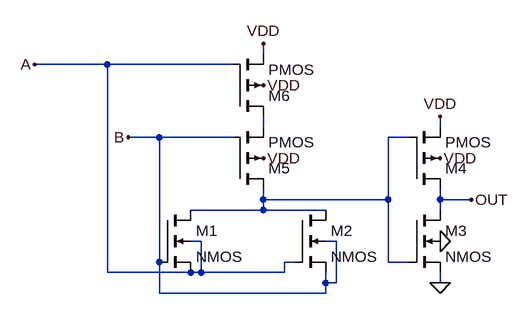
[diagram p0: schematic XOR.asc]
XOR.asc, the LTspice schematic file:
Version 4
SHEET 1 1076 680
WIRE 560 -416 560 -432
WIRE 320 -400 208 -400
WIRE 512 -400 320 -400
WIRE 560 -304 560 -320
WIRE 832 -304 832 -320
WIRE 400 -288 352 -288
WIRE 512 -288 400 -288
WIRE 784 -288 752 -288
WIRE 560 -192 560 -208
WIRE 752 -192 752 -288
WIRE 752 -192 560 -192
WIRE 832 -192 832 -208
WIRE 880 -192 832 -192
WIRE 560 -176 560 -192
WIRE 560 -176 448 -176
WIRE 656 -176 560 -176
WIRE 832 -176 832 -192
WIRE 464 -128 448 -128
WIRE 672 -128 656 -128
WIRE 400 -96 400 -288
WIRE 608 -96 592 -96
WIRE 752 -96 752 -192
WIRE 784 -96 752 -96
WIRE 320 -80 320 -400
WIRE 448 -80 320 -80
WIRE 464 -80 464 -128
WIRE 464 -80 448 -80
WIRE 592 -80 592 -96
WIRE 592 -80 464 -80
WIRE 656 -64 656 -80
WIRE 672 -64 672 -128
WIRE 672 -64 656 -64
WIRE 832 -64 832 -80
WIRE 400 -48 400 -96
WIRE 656 -48 656 -64
WIRE 656 -48 400 -48
FLAG 208 -400 A
FLAG 560 -256 VDD
FLAG 560 -368 VDD
FLAG 560 -432 VDD
FLAG 832 -128 0
FLAG 832 -64 0
FLAG 832 -256 VDD
FLAG 832 -320 VDD
FLAG 352 -288 B
FLAG 880 -192 OUT
SYMBOL nmos4 400 -176 R0
SYMATTR InstName M1
SYMBOL nmos4 608 -176 R0
SYMATTR InstName M2
SYMBOL nmos4 784 -176 R0
SYMATTR InstName M3
SYMBOL pmos4 784 -208 M180
SYMATTR InstName M4
SYMBOL pmos4 512 -208 M180
SYMATTR InstName M5
SYMBOL pmos4 512 -320 M180
SYMATTR InstName M6

The netlist it stands for:
* XOR.asc
M1 N002 B A A NMOS
M2 N002 A B B NMOS
M3 OUT N002 0 0 NMOS
M4 OUT N002 VDD VDD PMOS
M5 N002 B N001 VDD PMOS
M6 N001 A VDD VDD PMOS
.model NMOS NMOS
.model PMOS PMOS
.lib standard.mos
.backanno
.end